# EAGLE design SparkFun-Qwiic-Mini-Human-Presence-Sensor---STHS34PF80 (EAGLE 9.6.2)
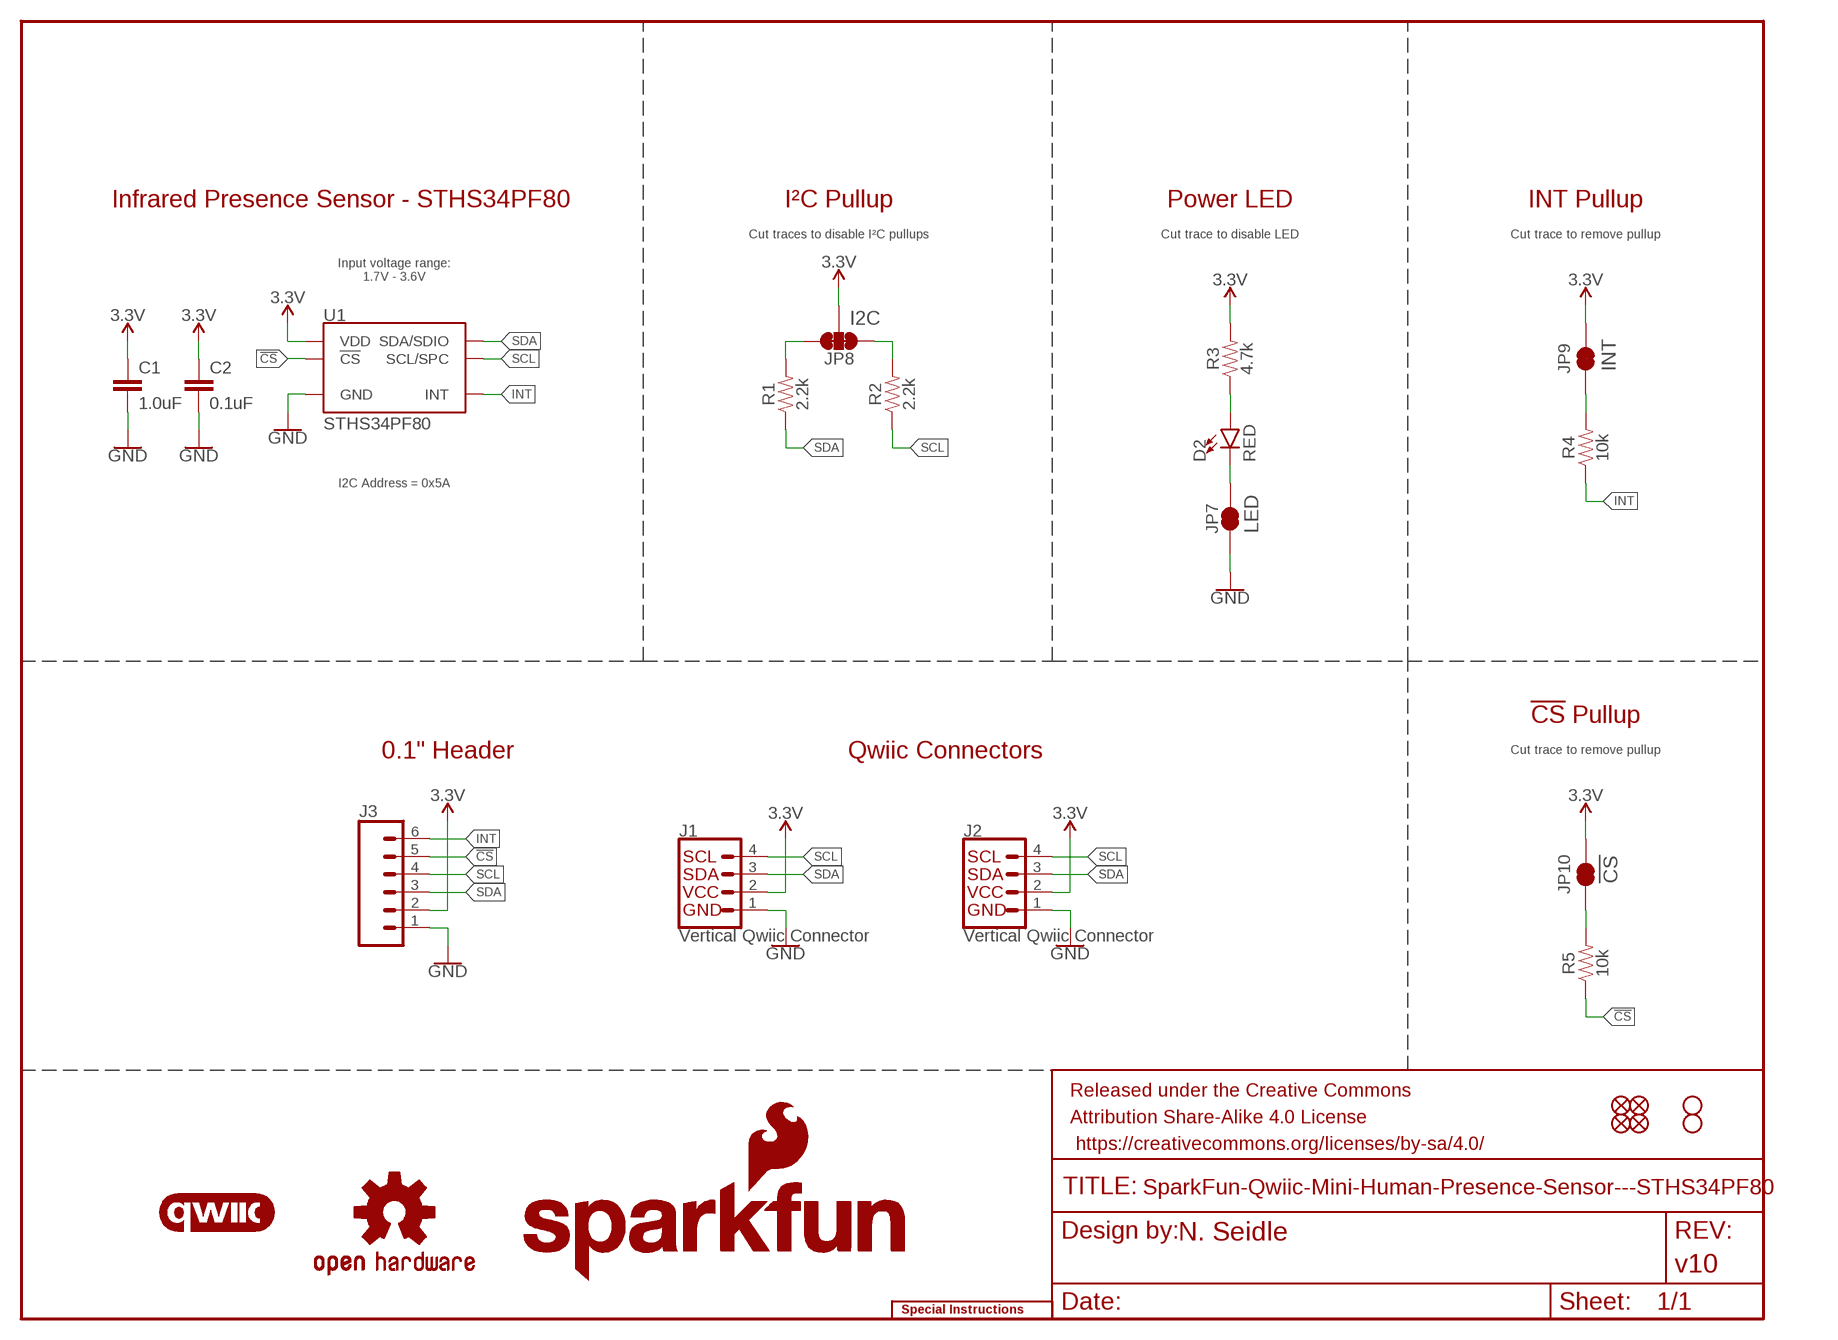
[diagram p0: schematic, sheet 1]

## Parts
C1  1.0uF  1.0UF-0603-16V-10%  [0603]
C2  0.1uF  0.1UF-0603-25V-(+80/-20%)  [0603]
D2  RED  LED-RED_0603-KB  [LED-0603]
FRAME1  FRAME-LETTER  [CREATIVE_COMMONS]
J1  Vertical Qwiic Connector  QWIIC_CONNECTOR  [JST04_1MM_VERT]
J2  Vertical Qwiic Connector  QWIIC_CONNECTOR  [JST04_1MM_VERT]
J3  CONN_06NO_SILK_FEMALE_PTH  [1X06_NO_SILK]
JP1  FIDUCIALUFIDUCIAL  [FIDUCIAL-MICRO]
JP2  FIDUCIALUFIDUCIAL  [FIDUCIAL-MICRO]
JP3  STAND-OFF  [STAND-OFF]
JP4  STAND-OFF  [STAND-OFF]
JP5  FIDUCIALUFIDUCIAL  [FIDUCIAL-MICRO]
JP6  FIDUCIALUFIDUCIAL  [FIDUCIAL-MICRO]
JP7  JUMPER-SMT_2_NC_TRACE_SILK  [SMT-JUMPER_2_NC_TRACE_SILK]
JP8  JUMPER-SMT_3_2-NC_TRACE_SILK  [SMT-JUMPER_3_2-NC_TRACE_SILK]
JP9  JUMPER-SMT_2_NC_TRACE_SILK  [SMT-JUMPER_2_NC_TRACE_SILK]
JP10  JUMPER-SMT_2_NC_TRACE_SILK  [SMT-JUMPER_2_NC_TRACE_SILK]
LOGO1  OSHW-LOGOS  [OSHW-LOGO-S]
LOGO2  SFE_LOGO_NAME_FLAME7_MM  [SFE_LOGO_NAME_FLAME_7MM]
LOGO3  QWIIC_LOGO_CONNECTOR  [QWIIC_5.5MM]
LOGO4  SFE_LOGO_NAME5_MM  [SFE_LOGO_NAME_5MM]
LOGO5  SPECIAL_INSTRUCTIONS-ORDERING  [ORDERING_INSTRUCTIONS]
LOGO6  SFE_LOGO_FLAME.1_INCH  [SFE_LOGO_FLAME_.1]
R1  2.2k  2.2KOHM-0603-1/10W-1%  [0603]
R2  2.2k  2.2KOHM-0603-1/10W-1%  [0603]
R3  4.7k  4.7KOHM-0603-1/10W-1%  [0603]
R4  10k  10KOHM-0603-1/10W-1%  [0603]
R5  10k  10KOHM-0603-1/10W-1%  [0603]
U1  STHS34PF80  [OLGA-10L]

## Nets
3.3V: C1.1 C2.1 J1.2 J2.2 J3.2 JP8.2 JP9.2 JP10.2 R3.2 U1.6(VDD) U1.9(VDD)
!CS!: J3.5 R5.1 U1.3(!CS!)
GND: C1.2 C2.2 J1.1 J2.1 J3.1 JP7.1 U1.2(GND) U1.7(GND) U1.8(GND)
INT: J3.6 R4.1 U1.10(INT)
N$1: D2.C JP7.2
N$2: JP8.3 R1.2
N$3: JP8.1 R2.2
N$4: D2.A R3.1
N$5: JP9.1 R4.2
N$6: JP10.1 R5.2
SCL: J1.4 J2.4 J3.4 R2.1 U1.1(SCL/SPC)
SDA: J1.3 J2.3 J3.3 R1.1 U1.4(SDA/SDIO)

## Notes on the sheet
- Infrared Presence Sensor - STHS34PF80 | I²C Pullup | Power LED | INT Pullup
- Cut traces to disable I²C pullups | Cut trace to disable LED | Cut trace to remove pullup
- Input voltage range:
  1.7V - 3.6V
- I2C
- INT
- I2C Address = 0x5A
- LED
- !CS! Pullup
- 0.1" Header | Qwiic Connectors | Cut trace to remove pullup
- !CS

## Library data of the parts
C1 = SparkFun-Capacitors:1.0UF: 1µF ceramic capacitors A capacitor is a passive two-terminal electrical component used to store electrical energy temporarily in an electric field.; PROD_ID: CAP-00868
C2 = SparkFun-Capacitors:0.1UF: 0.1µF ceramic capacitors A capacitor is a passive two-terminal electrical component used to store electrical energy temporarily in an electric field.; PROD_ID: CAP-00810
D2 = SparkFun-LED:LED-RED: Red SMD LED Used in manufacturing of most products at SparkFun Packages: 0603 - KB - KingBright (DIO-17976) SMD 0603 package [Datasheet] <https://www.kingbrightusa.com/images/catalog/SPEC/APT1608SURCK.pdf> 0603 - (DIO-00819, has gone EOL) SMD 0603 package 0603 SMART - SMD 0603 SMART package ( more efficient and expensive)[Product Link] <http://www.osram-os.com/Graphics/XPic2/00077099_0.pdf> 1206 - SMD1206 package [Product Link] <https://www.sparkfun.com/datasheets/DevTools/LilyPad/Q150OVS4.pdff> SparkFun Products: Pro Mini 328 -5V <https://www.sparkfun.com/products/821> RedBoard <https://www.sparkfun.com/products/12757> IOIO-OTG <https://www.sparkfun.com/products/13613>; PROD_ID: DIO-17976
FRAME1 = SparkFun-Aesthetics:FRAME-LETTER: Schematic Frame - Letter Standard 8.5x11 US Letter frame; DESIGNER: N. Seidle; REV: v10
J1 J2 = SparkFun-Connectors:QWIIC_CONNECTOR: SparkFun I2C Standard Qwiic Connector An SMD 1mm pitch JST connector makes it easy and quick (get it? Qwiic?) to connect I2C devices to each other. The Qwiic system <http://www.sparkfun.com/qwiic> enables fast and solderless connection between popular platforms and various sensors and actuators. We carry 200mm <https://www.sparkfun.com/products/14204>, 100mm <https://www.sparkfun.com/products/14205>, 50mm <https://www.sparkfun.com/products/14206>, and breadboard friendly <https://www.sparkfun.com/products/14207> Qwiic cables. We also offer 10 pcs strips <https://www.sparkfun.com/products/14323> the SMD connectors.; PROD_ID: CONN-14483
J3 = SparkFun-Connectors:CONN_06: Multi connection point. Often used as Generic Header-pin footprint for 0.1 inch spaced/style header connections On any of the 0.1 inch spaced packages, you can populate with these: Break Away Headers - Straight <https://www.sparkfun.com/products/116> (PRT-00116) Break Away Male Headers - Right Angle <https://www.sparkfun.com/products/553> (PRT-00553) Female Headers <https://www.sparkfun.com/products/115> (PRT-00115) Break Away Headers - Machine Pin <https://www.sparkfun.com/products/117> (PRT-00117) Break Away Female Headers - Swiss Machine Pin <https://www.sparkfun.com/products/743> (PRT-00743) Arduino Stackable Header - 6 Pin <https://www.sparkfun.com/products/9280> (PRT-09280) Screw Terminals 2.54mm Pitch (6-Pin) <https://www.sparkfun.com/products/16499> (PRT-16499) For SCREWTERMINALS and SPRING TERMINALS visit here: Screw Terimnals on SparkFun.com <https://www.sparkfun.com/search/results?term=Screw+Terminals> (5mm/3.5mm/2.54mm spacing) This device is also useful as a general connection point to wire up your design to another part of your project. Our various solder wires solder well into these plated through hole pads. Hook-Up Wire - Assortment (Stranded, 22 AWG) <https://www.sparkfun.com/products/11375> (PRT-11375) Hook-Up Wire - Assortment (Solid Core, 22 AWG) <https://www.sparkfun.com/products/11367> (PRT-11367) View the entire wire category on our website here <https://www.sparkfun.com/categories/141>; PROD_ID: CONN-08437
JP1 JP2 JP5 JP6 = SparkFun-Aesthetics:FIDUCIAL: Fiducial Alignment Points Point-of-reference for pick-and-place machines and other optical instruments.
JP3 JP4 = SparkFun-Hardware:STAND-OFF: Stand Off Drill holes for mechanically mounting via screws, standoffs, etc. Note: Use the keepout ring to avoid running the screw head into surrounding components. Variant Overviews STAND-OFF - Mechanical footprint for a #4 phillips button head screw. STAND-OFF-TIGHT - Mechanical footprint for a #4 phillips button head screw, Example SparkFun Products Screw - Phillips Head (1/4", 4-40, 10 pack) <https://www.sparkfun.com/products/10453> (PRT-10453) Screw - Phillips Head (1/2", 4-40, 10 pack) <https://www.sparkfun.com/products/10452> (PRT-10452) Screw - Phillips Head (3/4", 4-40, 10 pack) <https://www.sparkfun.com/products/10451> (PRT-10451) Screw - Phillips Head (1", 4-40, 10 pack) <https://www.sparkfun.com/products/10450> (PRT-10450)
JP7 JP9 JP10 = SparkFun-Jumpers:JUMPER-SMT_2_NC_TRACE: Normally closed trace jumper This jumper has a trace between two pads so it's normally closed (NC). Use a razor knife to open the connection. For best results follow the IPC guidelines for cutting traces: Cutout at least 0.063 mm (0.005 in). Remove all loose material to clean up the cut area. Seal the cut with an approved epoxy. Reapply solder to reclose the connection.
JP8 = SparkFun-Jumpers:JUMPER-SMT_3_2-NC_TRACE: Normally closed trace jumper (2 of 2 connections) This jumper has a trace between all three pads so they are normally closed (NC). Use a razor knife to open the connection(s). For best results follow the IPC guidelines for cutting traces: Cutout at least 0.063 mm (0.005 in). Remove all loose material to clean up the cut area. Seal the cut with an approved epoxy. Reapply solder to reclose the connection(s).
LOGO1 = SparkFun-Aesthetics:OSHW-LOGO: Open-Source Hardware (OSHW) Logo This logo indicates the piece of hardware it is found on incorporates a OSHW license and/or adheres to the definition of open source hardware found here: http://freedomdefined.org/OSHW
LOGO2 = SparkFun-Aesthetics:SFE_LOGO_NAME_FLAME: SparkFun Font Logo w/ Flame This is the SparkFun full logo. The logo on the schematic will always be the same size; the package variant is the height of the flame part of the logo. Default layer for the logo on the board is tSilk.
LOGO3 = SparkFun-Aesthetics:QWIIC_LOGO: Qwiic Logos for placement on schematic and PCB. The 5.5mm silk logo is best for placing next to Qwiic connector.
LOGO4 = SparkFun-Aesthetics:SFE_LOGO_NAME: SparkFun Font Logo This is the SparkFun name logo. The logo on the schematic will always be the same size; the package variant is the height of the flame part of the logo (or the height the flame would be, if it were drawn). Default layer for the logo on the board is tSilk.
LOGO5 = SparkFun-Aesthetics:SPECIAL_INSTRUCTIONS: Special Ordering/Production Instructions Alert Symbol for special PCB ordering instructions or unique production process warnings. Ordering Instructions Production Instructions Types of information that should be added to box: Copper weight Soldermask color Silk color PCB thickness Number of layers PCB Standard: 1.6mm FR4 1 oz copper immersion silver plating red soldermask white silkscreen Types of information that should be added to box: Special wash requirements Depaneling instructions Humidification Glue curing Default text settings: 0.07 inch 9% ratio 50% line distance
LOGO6 = SparkFun-Aesthetics:SFE_LOGO_FLAME: SparkFun Flame Logo This is the SparkFun flame logo. The logo on the schematic will always be the same size; the package variant is the height of the flame. Default layer for the logo on the board is tSilk.
R1 R2 = SparkFun-Resistors:2.2KOHM: 2.2kΩ resistor A resistor is a passive two-terminal electrical component that implements electrical resistance as a circuit element. Resistors act to reduce current flow, and, at the same time, act to lower voltage levels within circuits. - Wikipedia; PROD_ID: RES-08272
R3 = SparkFun-Resistors:4.7KOHM: 4.7kΩ resistor A resistor is a passive two-terminal electrical component that implements electrical resistance as a circuit element. Resistors act to reduce current flow, and, at the same time, act to lower voltage levels within circuits. - Wikipedia; PROD_ID: RES-07857
R4 R5 = SparkFun-Resistors:10KOHM: 10kΩ resistor A resistor is a passive two-terminal electrical component that implements electrical resistance as a circuit element. Resistors act to reduce current flow, and, at the same time, act to lower voltage levels within circuits. - Wikipedia; PROD_ID: RES-00824
U1 = STHS34PF80:STHS34PF80: Bosch BMP384 Pressure Sensor Senses pressure from 300 hPa to 1250 hPa, sends data out over I2C or SPI; PROD_ID: IC-19626

## Board
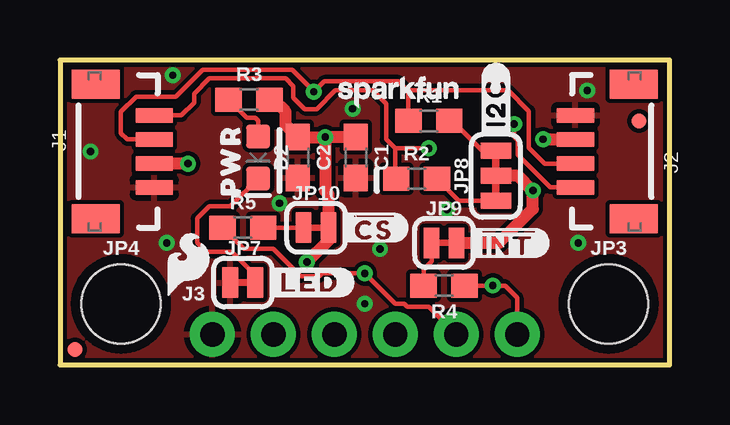
[diagram p1: board, top side]
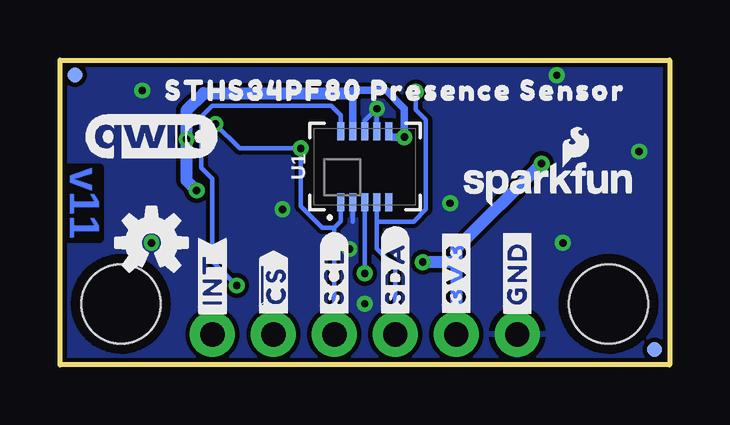
[diagram p2: board, bottom side, seen from below]

Size 25.4 x 12.7 mm. Coordinates in mm from the lower left corner, seen from the top.
Outline: 0,0 25.4,0 25.4,12.7 0,12.7 0,0
Copper layers (1*16): Top 0.035mm / dielectric 1.5mm / Bottom 0.035mm
Design rules "SparkFun-2-Layer-General-JLCPCB": minimum track width 7mil, minimum drill 0.3mm, track to track 7mil, track to pad 7mil, pad to pad 7mil, via to via 7mil, smd to smd 7mil, copper to edge 7mil, drill to drill 7mil, minimum pad ring 7mil, minimum via ring 7mil, stop-mask expansion 3mil, vias tented up to drill 25mil, thermal gap 10mil
bKeepout: area 10.4,6.5 to 15,10
bRestrict: area 10.4,6.5 to 15,10

### Footprints (pad centres in the part's own frame; a part is rotated, then mirrored left to right if it is on the bottom)
0603 = smd 1.1 x 1: 1 -0.85,0; 2 0.85,0
LED-0603 = smd 1 x 1: A -0.877,0; C 0.877,0
JST04_1MM_VERT = smd 0.6 x 1.55: 1 -1.5,0.775; 2 -0.5,0.775; 3 0.5,0.775; 4 1.5,0.775 | smd 1.2 x 2: NC1 -2.8,3.2; NC2 2.8,3.2
1X06_NO_SILK = drill 1.016 pad 1.88: 1 0,0; 2 2.54,0; 3 5.08,0; 4 7.62,0; 5 10.16,0; 6 12.7,0
FIDUCIAL-MICRO = smd 0.635 x 0.635: 1 0,0
STAND-OFF = hole 3.302: 0,0
SMT-JUMPER_2_NC_TRACE_SILK = smd 0.66 x 1.27: 1 -0.521,0; 2 0.521,0
SMT-JUMPER_3_2-NC_TRACE_SILK = smd 0.66 x 1.27: 1 -1.041,0; 2 0,0; 3 1.041,0
OLGA-10L = smd 0.75 x 0.285: 1 -1.475,1; 2 -1.475,0.5; 3 -1.475,0; 4 -1.475,-0.5; 5 -1.475,-1; 6 1.475,-1; 7 1.475,-0.5; 8 1.475,0; 9 1.475,0.5; 10 1.475,1

### Placement (x,y rotation side)
C1  12.32,8.64 270 top
C2  9.91,8.64 270 top
D2  8.26,8.64 270 top
FRAME1  -1.27,-26.67 0 top  (outside the outline)
J1  4.7,8.89 90 top
J2  20.7,8.89 270 top
J3  6.35,1.27 0 top
JP1  0.64,0.64 0 top
JP2  0.64,0.64 0 bottom
JP3  22.86,2.54 0 top
JP4  2.54,2.54 0 top
JP5  24.77,12.06 0 bottom
JP6  24.13,10.16 0 top
JP7  7.62,3.43 0 top
JP8  18.16,7.87 90 top
JP9  16,5.08 0 top
JP10  10.67,5.71 0 top
LOGO1  21.59,5.08 0 bottom
LOGO2  5.08,7.62 0 bottom
LOGO3  21.59,9.53 0 bottom
LOGO4  14.1,11.43 0 top
LOGO5  36.83,50.8 0 top  (outside the outline)
LOGO6  5.33,4.19 0 top
R1  15.37,10.16 0 top
R2  14.86,7.75 0 top
R3  7.87,11.05 0 top
R4  16,3.3 180 top
R5  7.62,5.71 0 top
U1  12.7,8.26 90 bottom
U$1  [#3V3#36]  8.89,3.81 90 bottom
U$2  [##CS#36]  16.51,3.3 90 bottom
U$3  [#SDA#5]  11.43,3.81 90 bottom
U$4  [#SCL#6]  13.97,3.68 90 bottom
U$5  [#INT#37]  19.05,3.56 90 bottom
U$6  [STHS34PF80_PRESENCE_SENSOR35]  11.43,11.43 0 bottom
U$7  [PWR9]  7.11,8.51 90 top
U$8  [#I2C#0]  18.16,10.92 90 top
U$9  [##CS#6]  13.08,5.71 0 top
U$10  [#LED#8]  10.41,3.43 0 top
U$11  [##INT#9]  18.67,5.08 0 top
U$13  [#GND#35]  6.35,3.81 90 bottom

### Tracks (layer width: path | path; a pad name or v marks a point on that pad's centre or on a via)
3.3V  (via drill 0.3)
  Top 0.508: R3.2 8.89,11.05 9.4,10.54 9.4,9.99 C2.1 v11.05,9.49 | JP9.2 18.29,5.08 19.71,6.5 v19.71,7.26 19.09,7.87 JP8.2 | v10.29,4.28 10.65,4.65 10.66,4.65 11.19,5.18 JP10.2 11.19,7.1 11.05,7.24 v11.05,9.49 | C1.1 v11.05,9.49 | J1.2 v5.33,8.39 v5.33,8.38 | v20.13,9.4 21.47,9.4 J2.2
  Bottom 0.305: U1.9 13.2,11.32 13.2,11.43 11.81,11.43 11.05,10.67 v11.05,9.49 11.58,9.49 11.7,9.6 U1.6
  Bottom 0.508: 8.89,4.28 v10.29,4.28 | 8.89,4.28 J3.2 | v5.33,8.38 8.89,4.83 8.89,4.28 | v19.71,7.26 20.13,7.68 v20.13,9.4 20.13,10.6 19.42,11.32 13.2,11.32
!CS!  (via drill 0.3)
  Top 0.178: J3.5 15.37,2.41 14.48,2.41 14.35,2.54 13.97,2.54 v12.7,3.81 10.92,3.81 10.79,3.68 10.03,3.68 8.89,4.83 7.66,4.83 R5.1
  Bottom 0.178: U1.3 v12.7,3.81
GND  (via drill 0.3)
  Bottom 0.178: U1.7 v12.19,10.67 12.7,10.16 U1.8 | U1.2 13.21,5.97
  other vias: 21.59,5.08 9.14,6.73 4.7,12.06 12.7,2.54 16.13,6.48 21.97,11.43 1.27,8.89 13.34,4.83 4.45,5.08
  pour Top (isolate 0.127): 0,12.7 25.4,12.7 25.4,0 0,0
  pour Bottom (isolate 0.127): 0,0 0,12.7 25.4,12.7 25.4,0
INT  (via drill 0.3)
  Top 0.178: R4.1 v18.03,3.3 18.54,3.3 19.05,2.79 J3.6
  Bottom 0.178: v18.03,3.3 19.05,4.32 19.05,7.75 19.52,8.22 19.52,10.32 19.05,10.79 14.1,10.79 13.7,10.4 U1.10
N$1
  Top 0.178: D2.C 7.1,6.6 6.22,6.6 5.71,6.1 5.71,5.08 6.08,4.71 7.16,4.71 8.14,3.73 JP7.2
N$2
  Top 0.178: R1.2 16.34,10.16 17.59,8.91 JP8.3
N$3
  Top 0.178: R2.2 16.62,6.83 JP8.1
N$4
  Top 0.178: R3.1 7.79,10.29 8.13,10.29 8.26,10.16 D2.A
N$5
  Top 0.178: R4.2 15.15,3.98 15.48,4.3 JP9.1
N$6
  Top 0.178: R5.2 JP10.1
SCL  (via drill 0.3)
  Top 0.178: v15.37,9.02 13.97,9.02 | R2.1 13.97,7.79 13.97,9.02 | 13.97,9.02 13.59,9.39 13.59,10.87 13.04,11.43 11.47,11.43 10.7,10.65 10.2,10.65 9.72,11.13 9.72,11.61 9.4,11.94 6.22,11.94 5.59,11.3 5.59,10.92 5.06,10.39 J1.4 | J2.4 20.42,7.39 19.06,8.75 19.06,9.36 18.92,9.5 v18.92,10.03
  Bottom 0.178: 13.97,5.71 13.7,5.99 U1.1 | J3.4 13.97,5.71 | 13.97,5.71 14.48,5.71 15.37,6.6 v15.37,9.02 17.91,9.02 v18.92,10.03
SDA  (via drill 0.3)
  Top 0.178: 14.52,11.43 18.67,11.43 19.53,10.57 19.53,9.04 20.19,8.38 21.47,8.38 J2.3 | R1.1 14.52,11.43 | 14.52,11.43 14.48,11.43 14.1,11.81 11.01,11.81 v10.57,11.38 10.57,11.4 9.68,12.29 5.94,12.29 4.83,11.18 3.17,11.18 2.54,10.54 2.54,9.65 2.8,9.39 J1.3
  Bottom 0.178: J3.3 11.43,4.06 12.2,4.83 12.2,5.97 | 12.2,5.97 10.67,5.97 10.16,6.48 10.16,10.2 10.57,10.62 v10.57,11.38 | U1.4 12.2,5.97

### Text on the board
Bottom: v11
Measures: Units in inches
tDocu: Solder Mask: Red / Thickness: 1.6mm / Two layer design / Finish: HASL Lead-Free / Copper Weight: 1oz / Material: TG135-140 | M. Chodikov